# Altium project USB_HUB_MEASURE.PrjPcb
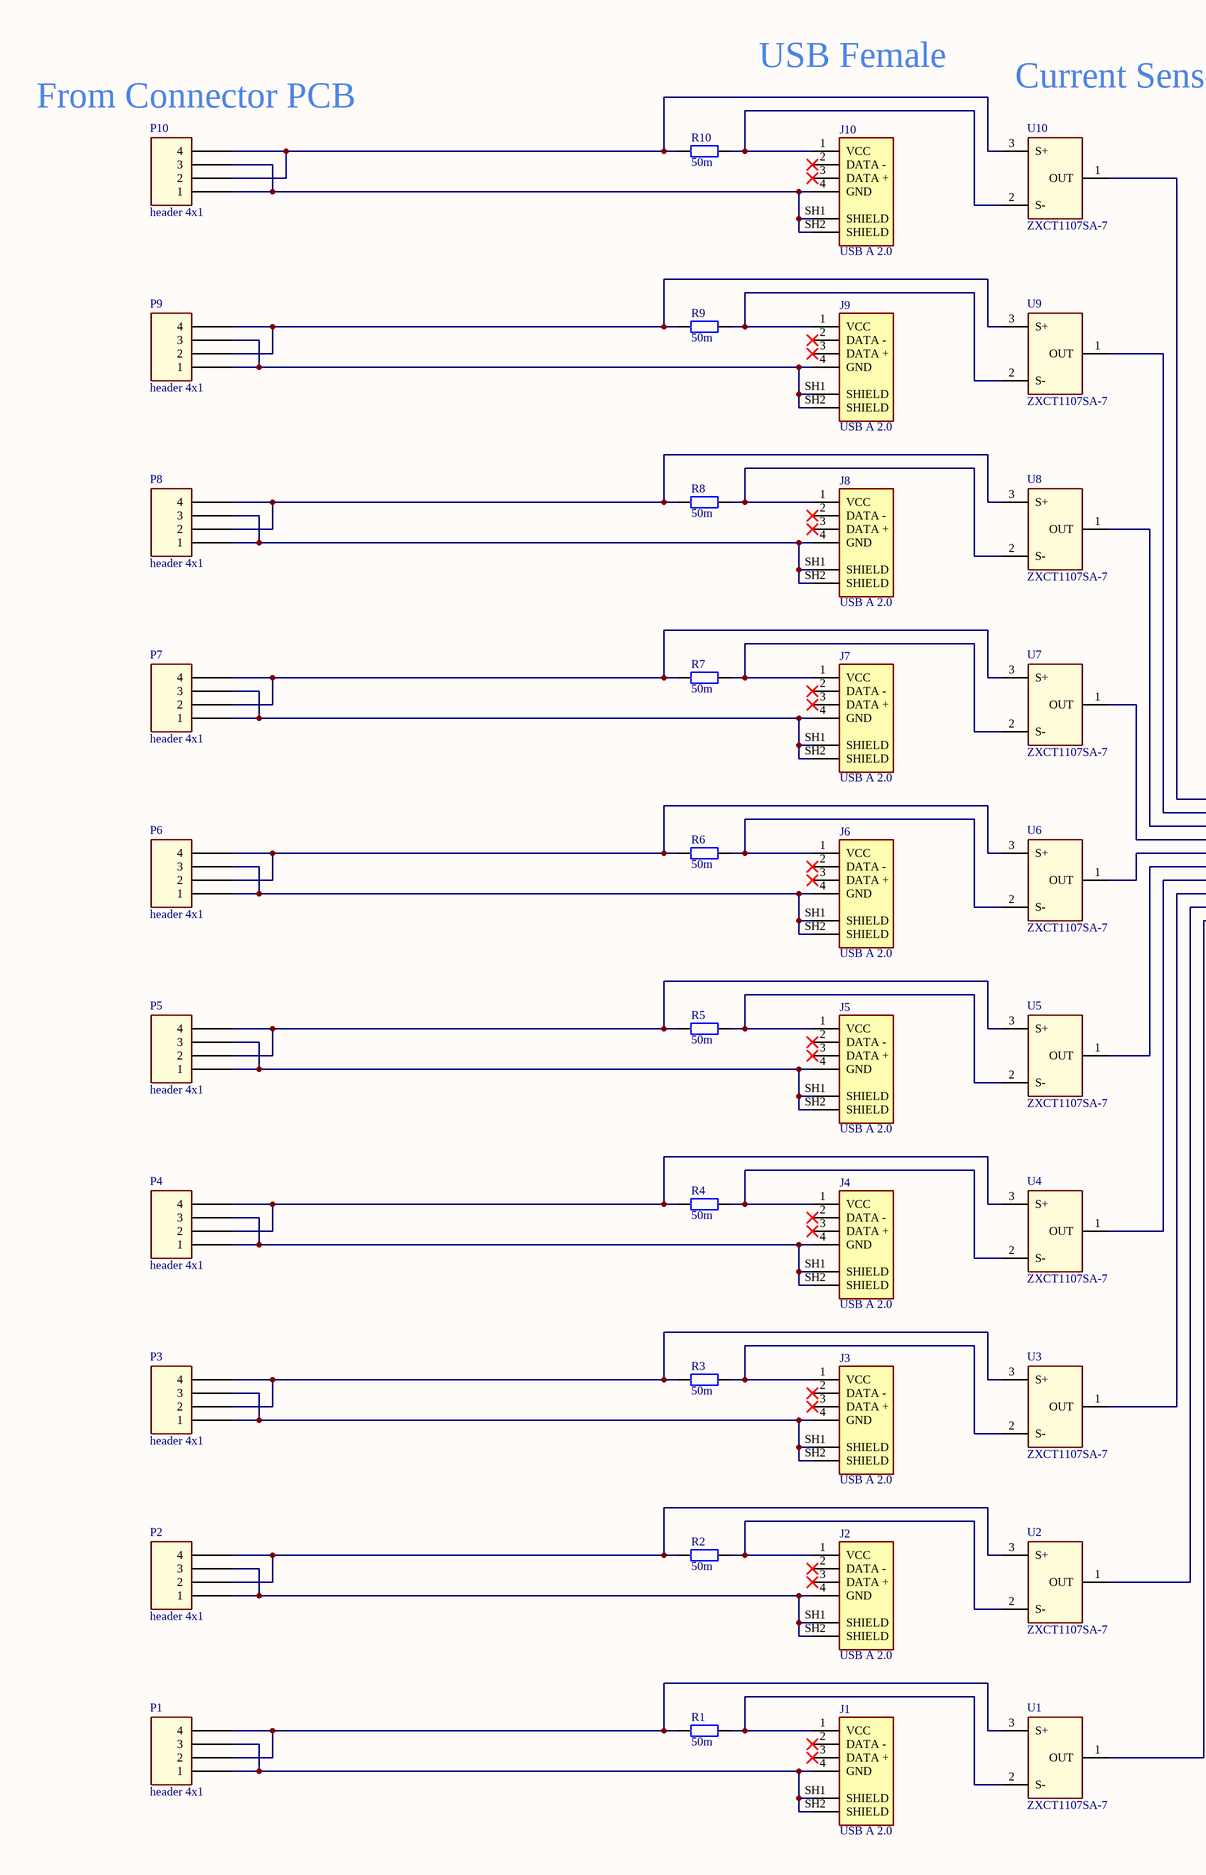
[diagram p0: schematic.SchDoc, left]
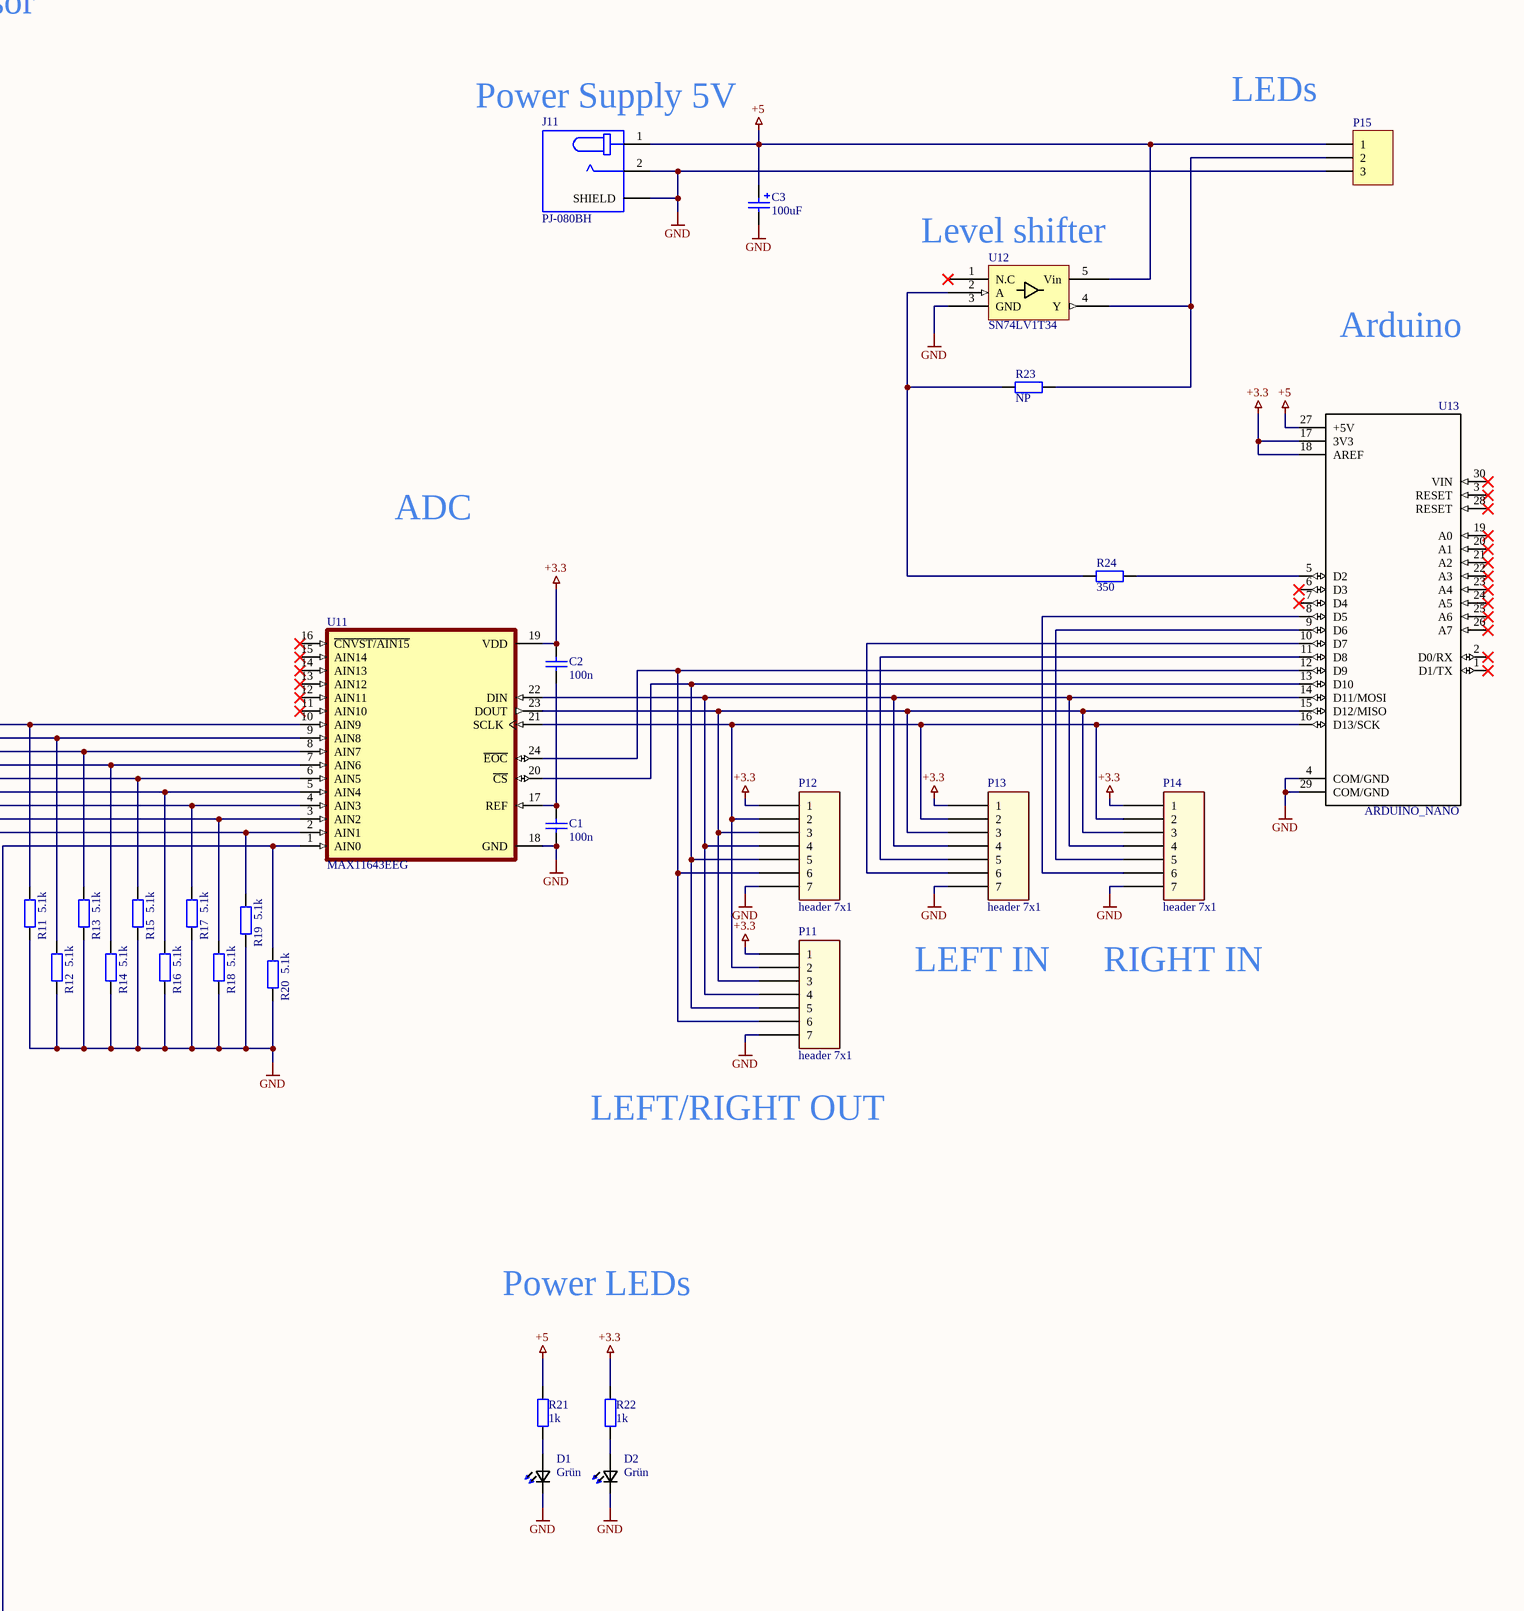
[diagram p1: schematic.SchDoc, right]
1 sheet, 68 parts. Net scope: global (net labels, ports and power ports of the same name join across sheets).
Board file: USB_Hub_Main.PcbDoc

## Sheet schematic.SchDoc
size A2

### Parts
C1  100n  [CAP_0603i_1608m -N]
C2  100n  [CAP_0603i_1608m -N]
C3  100uF  [Cap_F-Type-Package]
D1  Grün  [*0603]
D2  Grün  [*0603]
J1  USB A 2.0  [54-00005]
J2  USB A 2.0  [54-00005]
J3  USB A 2.0  [54-00005]
J4  USB A 2.0  [54-00005]
J5  USB A 2.0  [54-00005]
J6  USB A 2.0  [54-00005]
J7  USB A 2.0  [54-00005]
J8  USB A 2.0  [54-00005]
J9  USB A 2.0  [54-00005]
J10  USB A 2.0  [54-00005]
J11  PJ-080BH  [CUI_PJ-080BH]
P1  header 4x1  [4x1, 2.54mm, smd]
P2  header 4x1  [4x1, 2.54mm, smd]
P3  header 4x1  [4x1, 2.54mm, smd]
P4  header 4x1  [4x1, 2.54mm, smd]
P5  header 4x1  [4x1, 2.54mm, smd]
P6  header 4x1  [4x1, 2.54mm, smd]
P7  header 4x1  [4x1, 2.54mm, smd]
P8  header 4x1  [4x1, 2.54mm, smd]
P9  header 4x1  [4x1, 2.54mm, smd]
P10  header 4x1  [4x1, 2.54mm, smd]
P11  header 7x1  [7 pin, 3.5mm]
P12  header 7x1  [7 pin, 3.5mm]
P13  header 7x1  [7 pin, 3.5mm]
P14  header 7x1  [7 pin, 3.5mm]
P15  Header 3  [3.5MM Phoenix Contact 1751251]  (value not drawn)
R1  50m  [RES_0805i_2012m -N]
R2  50m  [RES_0805i_2012m -N]
R3  50m  [RES_0805i_2012m -N]
R4  50m  [RES_0805i_2012m -N]
R5  50m  [RES_0805i_2012m -N]
R6  50m  [RES_0805i_2012m -N]
R7  50m  [RES_0805i_2012m -N]
R8  50m  [RES_0805i_2012m -N]
R9  50m  [RES_0805i_2012m -N]
R10  50m  [RES_0805i_2012m -N]
R11  5.1k  [RES_0603i_1608m -N]
R12  5.1k  [RES_0603i_1608m -N]
R13  5.1k  [RES_0603i_1608m -N]
R14  5.1k  [RES_0603i_1608m -N]
R15  5.1k  [RES_0603i_1608m -N]
R16  5.1k  [RES_0603i_1608m -N]
R17  5.1k  [RES_0603i_1608m -N]
R18  5.1k  [RES_0603i_1608m -N]
R19  5.1k  [RES_0603i_1608m -N]
R20  5.1k  [RES_0603i_1608m -N]
R21  1k  [RES_0603i_1608m -N]
R22  1k  [RES_0603i_1608m -N]
R23  NP  [RES_0603i_1608m -N]
R24  350  [RES_0603i_1608m -N]
U1  ZXCT1107SA-7  [SOT-23-M]
U2  ZXCT1107SA-7  [SOT-23-M]
U3  ZXCT1107SA-7  [SOT-23-M]
U4  ZXCT1107SA-7  [SOT-23-M]
U5  ZXCT1107SA-7  [SOT-23-M]
U6  ZXCT1107SA-7  [SOT-23-M]
U7  ZXCT1107SA-7  [SOT-23-M]
U8  ZXCT1107SA-7  [SOT-23-M]
U9  ZXCT1107SA-7  [SOT-23-M]
U10  ZXCT1107SA-7  [SOT-23-M]
U11  MAX11643EEG  [SOP63P602X175-24N]
U12  SN74LV1T34  [SOT23-5-N]
U13  ARDUINO_NANO  [*SHIELD_ARDUINO_NANO]

### Nets
+3.3: C2.2 P11.1 P12.1 P13.1 P14.1 R22.2 U11.19(VDD) U13.17(3V3) U13.18(AREF)
+5: C3.1 J11.1 P15.1 R21.2 U12.5(Vin) U13.27(+5V)
GND: C1.1 C3.2 D1.1(K2) D2.1(K2) J11.2 J11.3(SHIELD) P11.7 P12.7 P13.7 P14.7 P15.3 R11.1 R12.1 R13.1 R14.1 R15.1 R16.1 R17.1 R18.1 R19.1 R20.1 U11.18(GND) U12.3(GND) U13.4(COM/GND) U13.29(COM/GND)
NetC1_2: C1.2 C2.1 U11.17(REF)
NetD1_2: D1.2(A2) R21.1
NetD2_2: D2.2(A2) R22.1
NetJ1_1: J1.1(VCC) R1.2 U1.2(S-)
NetJ1_4: J1.4(GND) J1.SH1(SHIELD) J1.SH2(SHIELD) P1.1 P1.3
NetJ2_1: J2.1(VCC) R2.2 U2.2(S-)
NetJ2_4: J2.4(GND) J2.SH1(SHIELD) J2.SH2(SHIELD) P2.1 P2.3
NetJ3_1: J3.1(VCC) R3.2 U3.2(S-)
NetJ3_4: J3.4(GND) J3.SH1(SHIELD) J3.SH2(SHIELD) P3.1 P3.3
NetJ4_1: J4.1(VCC) R4.2 U4.2(S-)
NetJ4_4: J4.4(GND) J4.SH1(SHIELD) J4.SH2(SHIELD) P4.1 P4.3
NetJ5_1: J5.1(VCC) R5.2 U5.2(S-)
NetJ5_4: J5.4(GND) J5.SH1(SHIELD) J5.SH2(SHIELD) P5.1 P5.3
NetJ6_1: J6.1(VCC) R6.2 U6.2(S-)
NetJ6_4: J6.4(GND) J6.SH1(SHIELD) J6.SH2(SHIELD) P6.1 P6.3
NetJ7_1: J7.1(VCC) R7.2 U7.2(S-)
NetJ7_4: J7.4(GND) J7.SH1(SHIELD) J7.SH2(SHIELD) P7.1 P7.3
NetJ8_1: J8.1(VCC) R8.2 U8.2(S-)
NetJ8_4: J8.4(GND) J8.SH1(SHIELD) J8.SH2(SHIELD) P8.1 P8.3
NetJ9_1: J9.1(VCC) R9.2 U9.2(S-)
NetJ9_4: J9.4(GND) J9.SH1(SHIELD) J9.SH2(SHIELD) P9.1 P9.3
NetJ10_1: J10.1(VCC) R10.2 U10.2(S-)
NetJ10_4: J10.4(GND) J10.SH1(SHIELD) J10.SH2(SHIELD) P10.1 P10.3
NetP1_2: P1.2 P1.4 R1.1 U1.3(S+)
NetP2_2: P2.2 P2.4 R2.1 U2.3(S+)
NetP3_2: P3.2 P3.4 R3.1 U3.3(S+)
NetP4_2: P4.2 P4.4 R4.1 U4.3(S+)
NetP5_2: P5.2 P5.4 R5.1 U5.3(S+)
NetP6_2: P6.2 P6.4 R6.1 U6.3(S+)
NetP7_2: P7.2 P7.4 R7.1 U7.3(S+)
NetP8_2: P8.2 P8.4 R8.1 U8.3(S+)
NetP9_2: P9.2 P9.4 R9.1 U9.3(S+)
NetP10_2: P10.2 P10.4 R10.1 U10.3(S+)
NetP11_2: P11.2 P12.2 P13.2 P14.2 U11.21(SCLK) U13.16(D13/SCK)
NetP11_3: P11.3 P12.3 P13.3 P14.3 U11.23(DOUT) U13.15(D12/MISO)
NetP11_4: P11.4 P12.4 P13.4 P14.4 U11.22(DIN) U13.14(D11/MOSI)
NetP11_5: P11.5 P12.5 U11.20(~{CS}) U13.13(D10)
NetP11_6: P11.6 P12.6 U11.24(~{EOC}) U13.12(D9)
NetP13_5: P13.5 U13.11(D8)
NetP13_6: P13.6 U13.10(D7)
NetP14_5: P14.5 U13.9(D6)
NetP14_6: P14.6 U13.8(D5)
NetP15_2: P15.2 R23.2 U12.4(Y)
NetR11_2: R11.2 U10.1(OUT) U11.10(AIN9)
NetR12_2: R12.2 U9.1(OUT) U11.9(AIN8)
NetR13_2: R13.2 U8.1(OUT) U11.8(AIN7)
NetR14_2: R14.2 U7.1(OUT) U11.7(AIN6)
NetR15_2: R15.2 U6.1(OUT) U11.6(AIN5)
NetR16_2: R16.2 U5.1(OUT) U11.5(AIN4)
NetR17_2: R17.2 U4.1(OUT) U11.4(AIN3)
NetR18_2: R18.2 U3.1(OUT) U11.3(AIN2)
NetR19_2: R19.2 U2.1(OUT) U11.2(AIN1)
NetR20_2: R20.2 U1.1(OUT) U11.1(AIN0)
NetR23_1: R23.1 R24.1 U12.2(A)
NetR24_2: R24.2 U13.5(D2)

Not connected (* = marked no-connect by the designer): J1 2(DATA_-)* 3(DATA_+)*; J2 2(DATA_-)* 3(DATA_+)*; J3 2(DATA_-)* 3(DATA_+)*; J4 2(DATA_-)* 3(DATA_+)*; J5 2(DATA_-)* 3(DATA_+)*; J6 2(DATA_-)* 3(DATA_+)*; J7 2(DATA_-)* 3(DATA_+)*; J8 2(DATA_-)* 3(DATA_+)*; J9 2(DATA_-)* 3(DATA_+)*; J10 2(DATA_-)* 3(DATA_+)*; U11 11(AIN10)* 12(AIN11)* 13(AIN12)* 14(AIN13)* 15(AIN14)* 16(~{CNVST/AIN15})*; U12 1(N.C)*; U13 1(D1/TX)* 2(D0/RX)* 3(RESET)* 6(D3)* 7(D4)* 19(A0)* 20(A1)* 21(A2)* 22(A3)* 23(A4)* 24(A5)* 25(A6)* 26(A7)* 28(RESET)* 30(VIN)*

### Notes on the sheet
- USB Female
- (near P10) From Connector PCB
- Current Sensor
- (near J11) Power Supply 5V
- LEDs
- (near U12) Level shifter
- Arduino
- ADC
- LEFT IN
- RIGHT IN
- LEFT/RIGHT OUT
- Power LEDs
- Drawing title:
- Drawing number:
- Rev:
- Format:
- Laboratory:
- Project:
- File:
- Date:
- A2
- Drawn by:
- Page
- of

### Library data of the parts
C1 C2 = Cap: capacitor
C3 = Cap pol: Polarised capacitor (e.g. Electrolytic )
D1 D2 = LTST-C191KGKT: / LED; SMD; 0603; grün; 35mcd; 1.6x0.8x0.55mm; 130Â°; 2Ã·2.V; 20mA /; MF: Lite-On Inc.; Digi-Key_Purchase_URL: https://www.digikey.ch/product-detail/de/lite-on-inc/LTST-C191KGKT/160-1446-1-ND/386834; SnapEDA_Link: https://www.snapeda.com/parts/LTST-C191KFKT/Lite-On%20Inc./view-part/?ref=snap; MP: LTST-C191KGKT; Digi-Key_Part_Number: 160-1446-1-ND; Package: 0603 Lite-On; Value: *
J1-J10 = USB A 2.0: Type A, USB 2.0, 1 A, Vertical, Through Hole, USB Receptacle; MP: UJ2-AV-2-TH; MF: CUI Devices; Package: None; SnapEDA_Link: https://www.snapeda.com/parts/UJ2-AV-2-TH/CUI%20Devices/view-part/2779619/?ref=snap; CUI_purchase_URL: https://www.cuidevices.com/product/interconnect/connectors/usb-connectors/uj2-av-th-series?utm_source=snapeda.com&utm_medium=referral&utm_campaign=snapedaBOM; Mouser-Purchase-URL: https://snapeda.com/shop?store=Mouser&id=2779619; DigiKey-Purchase-URL: https://snapeda.com/shop?store=DigiKey&id=2779619; Value: *; Digi-Key_Part_Number: 102-5880-ND
J11 = PJ-080BH: 2.5 x 6.4 mm, 10.0 A, Horizontal, Through Hole, Shielded, Dc Power Jack Connector; MF: CUI Devices; Package: None; Availability: Unavailable; Value: *; CUI_purchase_URL: https://www.cuidevices.com/product/interconnect/connectors/dc-power-connectors/jacks/pj-080bh?utm_source=snapeda.com&utm_medium=referral&utm_campaign=snapedaBOM; MP: PJ-080BH; SnapEDA_Link: https://www.snapeda.com/parts/PJ-080BH/CUI%20Devices/view-part/696898/?ref=snap; Price: None
P11 = header 7x1: right out
P12 = header 7x1: left out
P13 = header 7x1: left in
P14 = header 7x1: right in
P15 = Header 3: Header, 3-Pin
R1-R24 = Res: Resistor
U11 = MAX11642EEG: 8 Bit Analog to Digital Converter 16 Input 1 SAR 24-QSOP; MP: MAX11642EEG+; MF: Maxim Integrated; SnapEDA_Link: https://www.snapeda.com/parts/MAX11642EEG+/Maxim%20Integrated/view-part/693449/?ref=snap; Value: *; Package: QSOP-24 Maxim; Digi-Key_Part_Number: MAX11642EEG+T-ND
U12 = SN74LV1T34: Single Power Supply Single Buffer GATE CMOS Logic Level Shifter; Manufactuer Part Number: SN74LV1T34DCKR; Manufacturer: TI
U13 = ARDUINO_NANO: Dev.kit: Arduino; UART; ICSP, USB B mini, pin strips; MP: ARDUINO NANO; Digi-Key_Purchase_URL: *; Digi-Key_Part_Number: *; MF: Arduino; Package: None; SnapEDA_Link: https://www.snapeda.com/parts/ARDUINO%20NANO/Arduino/view-part/?ref=snap; Value: *